# Altium schematic sheet FPGA_Configuration.SchDoc: FPGA_Configuration
size A3; Date: 18/06/2014; DrawnBy: J. Gabriel R.E.; Organization: Seven Solutions S.L.; Address1: C/Baza, Parcela 19, Nave 3; Address2: Polнgono Ind. Juncaril; Address3: 18210-Peligros-Granada; Address4: Spain; Revision: 3.4; SheetNumber: 8; SheetTotal: 23; WebAddress: www.sevensols.com; Project: White Rabbit; ProjectName: Project Name
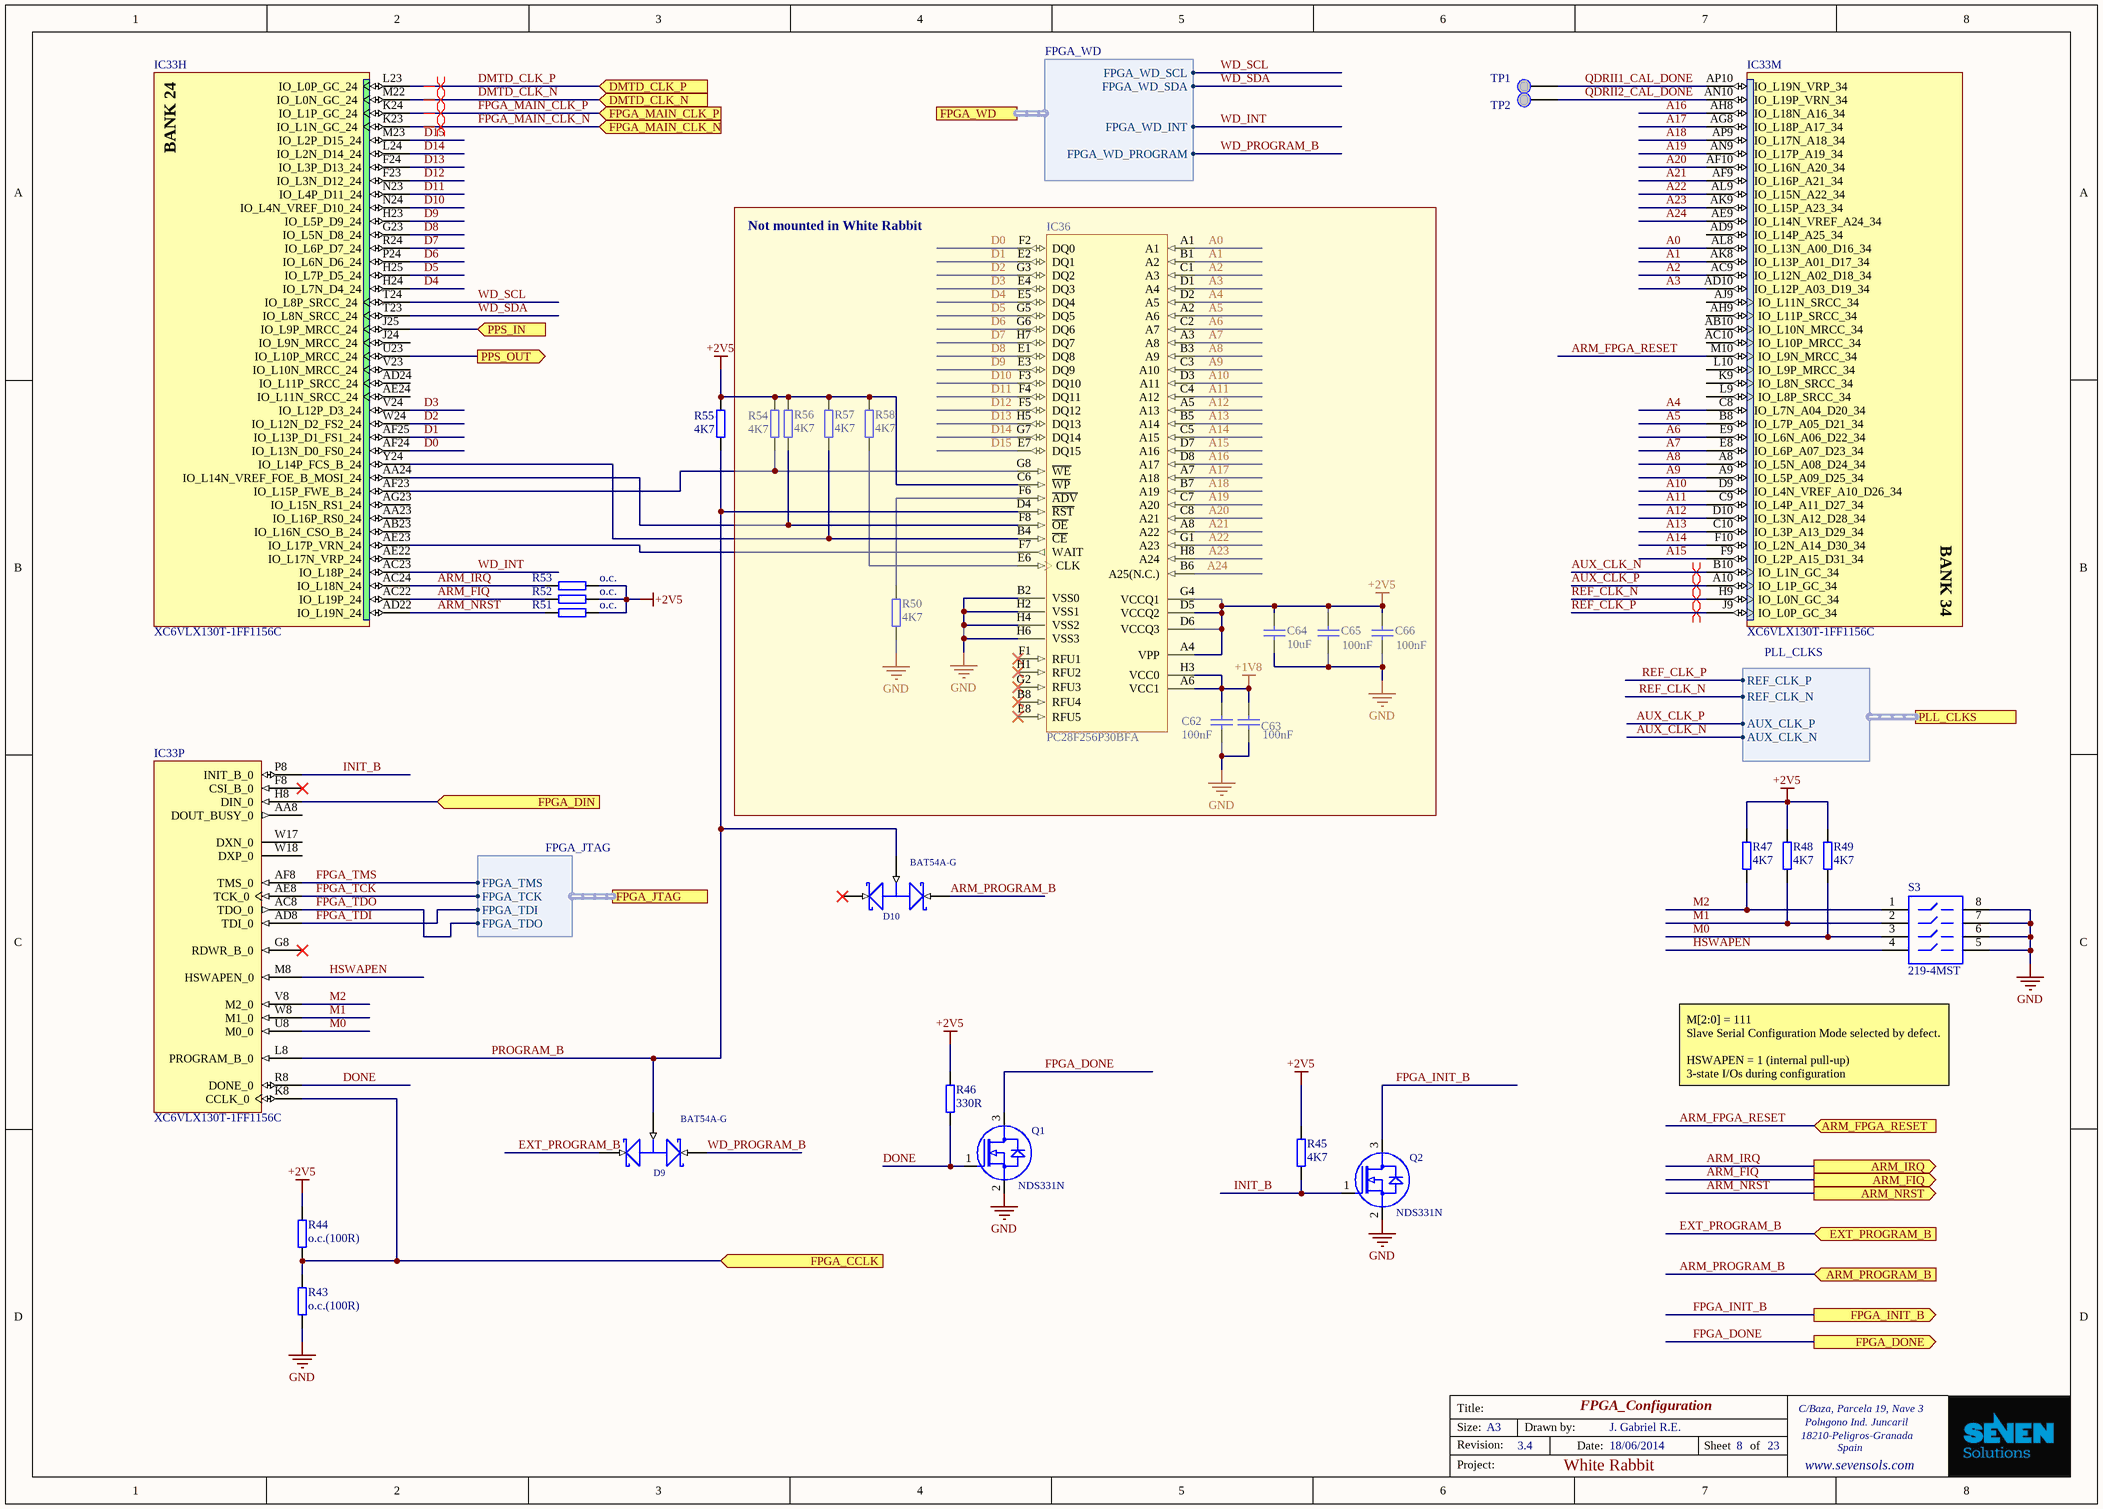
[diagram p0: FPGA_Configuration.SchDoc]

## Parts
C62  100nF  [CC1005-0402]
C63  100nF  [CC1005-0402]
C64  10uF  [CC1608-0603]
C65  100nF  [CC1005-0402]
C66  100nF  [CC1005-0402]
D9  BAT54A-G  [SOT23]
D10  BAT54A-G  [SOT23]
IC33  XC6VLX130T-1FF1156C  [FF1156]  (parts H,M,P of 20)
IC36  PC28F256P30BFA  [BGA64C100P8X8_1300X1000X120]
Q1  NDS331N  [SOT23-3]
Q2  NDS331N  [SOT23-3]
R43  value o.c.(100R)  [0402]  (hidden comment: 100R(o.c.))
R44  value o.c.(100R)  [0402]  (hidden comment: 100R(o.c.))
R45  4K7  [0402]
R46  330R  [0402]
R47  4K7  [0402]
R48  4K7  [0402]
R49  4K7  [0402]
R50  4K7  [0402]
R51  o.c.  [0402]
R52  o.c.  [0402]
R53  o.c.  [0402]
R54  4K7  [0402]
R55  4K7  [0402]
R56  4K7  [0402]
R57  4K7  [0402]
R58  4K7  [0402]
S3  219-4MST  [NHDS-8]
TP1  Test Point  [TEST_PAD_1mm]  (value not drawn)
TP2  Test Point  [TEST_PAD_1mm]  (value not drawn)

## Blocks framed on the sheet
Not mounted in White Rabbit: C62-C66 IC36 R50 R54 R56-R58

## Ports
ARM_FIQ (out), ARM_FPGA_RESET (in), ARM_IRQ (out), ARM_NRST (out), ARM_PROGRAM_B (in), DMTD_CLK_N (in), DMTD_CLK_P (in), EXT_PROGRAM_B (in), FPGA_CCLK (in), FPGA_DIN (in), FPGA_DONE (out), FPGA_INIT_B (out), FPGA_JTAG (harness FPGA_JTAG), FPGA_MAIN_CLK_N (in), FPGA_MAIN_CLK_P (in), FPGA_WD (harness FPGA_WD), PLL_CLKS (harness PLL_CLKS), PPS_IN (in), PPS_OUT (out)

## Harnesses
FPGA_JTAG: FPGA_TMS, FPGA_TCK, FPGA_TDI, FPGA_TDO
FPGA_WD: FPGA_WD_SCL, FPGA_WD_SDA, FPGA_WD_INT, FPGA_WD_PROGRAM
PLL_CLKS: REF_CLK_P, REF_CLK_N, AUX_CLK_P, AUX_CLK_N

## Nets
+1V8: C62.2 C63.2 IC36.A6(VCC1) IC36.H3(VCC0)
+2V5: C64.2 C65.2 C66.2 IC36.A4(VPP) IC36.C6(~{WP}) IC36.D5(VCCQ2) IC36.D6(VCCQ3) IC36.G4(VCCQ1) R44.2 R45.1 R46.2 R47.2 R48.2 R49.2 R51.1 R52.1 R53.1 R54.2 R55.2 R56.2 R57.2 R58.2
GND: C62.1 C63.1 C64.1 C65.1 C66.1 IC36.B2(VSS0) IC36.H2(VSS1) IC36.H4(VSS2) IC36.H6(VSS3) Q1.2(SOURCE) Q2.2(SOURCE) R43.1 R50.1 S3.5 S3.6 S3.7 S3.8
A0: IC33.AL8(IO_L13N_A00_D16_34) IC36.A1
A1: IC33.AK8(IO_L13P_A01_D17_34) IC36.B1(A2)
A2: IC33.AC9(IO_L12N_A02_D18_34) IC36.C1(A3)
A3: IC33.AD10(IO_L12P_A03_D19_34) IC36.D1(A4)
A4: IC33.C8(IO_L7N_A04_D20_34) IC36.D2(A5)
A5: IC33.B8(IO_L7P_A05_D21_34) IC36.A2(A6)
A6: IC33.E9(IO_L6N_A06_D22_34) IC36.C2(A7)
A7: IC33.E8(IO_L6P_A07_D23_34) IC36.A3(A8)
A8: IC33.A8(IO_L5N_A08_D24_34) IC36.B3(A9)
A9: IC33.A9(IO_L5P_A09_D25_34) IC36.C3(A10)
A10: IC33.D9(IO_L4N_VREF_A10_D26_34) IC36.D3(A11)
A11: IC33.C9(IO_L4P_A11_D27_34) IC36.C4(A12)
A12: IC33.D10(IO_L3N_A12_D28_34) IC36.A5(A13)
A13: IC33.C10(IO_L3P_A13_D29_34) IC36.B5(A14)
A14: IC33.F10(IO_L2N_A14_D30_34) IC36.C5(A15)
A15: IC33.F9(IO_L2P_A15_D31_34) IC36.D7(A16)
A16: IC33.AH8(IO_L18N_A16_34) IC36.D8(A17)
A17: IC33.AG8(IO_L18P_A17_34) IC36.A7(A18)
A18: IC33.AP9(IO_L17N_A18_34) IC36.B7(A19)
A19: IC33.AN9(IO_L17P_A19_34) IC36.C7(A20)
A20: IC33.AF10(IO_L16N_A20_34) IC36.C8(A21)
A21: IC33.AF9(IO_L16P_A21_34) IC36.A8(A22)
A22: IC33.AL9(IO_L15N_A22_34) IC36.G1(A23)
A23: IC33.AK9(IO_L15P_A23_34) IC36.H8(A24)
A24: IC33.AE9(IO_L14N_VREF_A24_34) IC36.B6(A25(N.C.))
ARM_FIQ: IC33.AC22(IO_L19P_24) R52.2 ; port ARM_FIQ
ARM_FPGA_RESET: IC33.M10(IO_L9N_MRCC_34) ; port ARM_FPGA_RESET
ARM_IRQ: IC33.AC24(IO_L18N_24) R53.2 ; port ARM_IRQ
ARM_NRST: IC33.AD22(IO_L19N_24) R51.2 ; port ARM_NRST
ARM_PROGRAM_B: D10.2(K2) ; port ARM_PROGRAM_B
AUX_CLK_N: IC33.B10(IO_L1N_GC_34) ; port PLL_CLKS.AUX_CLK_N
AUX_CLK_P: IC33.A10(IO_L1P_GC_34) ; port PLL_CLKS.AUX_CLK_P
D0: IC33.AF24(IO_L13N_D0_FS0_24) IC36.F2(DQ0)
D1: IC33.AF25(IO_L13P_D1_FS1_24) IC36.E2(DQ1)
D2: IC33.W24(IO_L12N_D2_FS2_24) IC36.G3(DQ2)
D3: IC33.V24(IO_L12P_D3_24) IC36.E4(DQ3)
D4: IC33.H24(IO_L7N_D4_24) IC36.E5(DQ4)
D5: IC33.H25(IO_L7P_D5_24) IC36.G5(DQ5)
D6: IC33.P24(IO_L6N_D6_24) IC36.G6(DQ6)
D7: IC33.R24(IO_L6P_D7_24) IC36.H7(DQ7)
D8: IC33.G23(IO_L5N_D8_24) IC36.E1(DQ8)
D9: IC33.H23(IO_L5P_D9_24) IC36.E3(DQ9)
D10: IC33.N24(IO_L4N_VREF_D10_24) IC36.F3(DQ10)
D11: IC33.N23(IO_L4P_D11_24) IC36.F4(DQ11)
D12: IC33.F23(IO_L3N_D12_24) IC36.F5(DQ12)
D13: IC33.F24(IO_L3P_D13_24) IC36.H5(DQ13)
D14: IC33.L24(IO_L2N_D14_24) IC36.G7(DQ14)
D15: IC33.M23(IO_L2P_D15_24) IC36.E7(DQ15)
DMTD_CLK_N: IC33.M22(IO_L0N_GC_24) ; port DMTD_CLK_N
DMTD_CLK_P: IC33.L23(IO_L0P_GC_24) ; port DMTD_CLK_P
DONE: IC33.R8(DONE_0) Q1.1(GATE) R46.1
EXT_PROGRAM_B: D9.1(K1) ; port EXT_PROGRAM_B
FPGA_CCLK: IC33.K8(CCLK_0) R43.2 R44.1 ; port FPGA_CCLK
FPGA_DIN: IC33.H8(DIN_0) ; port FPGA_DIN
FPGA_DONE: Q1.3(DRAIN) ; port FPGA_DONE
FPGA_INIT_B: Q2.3(DRAIN) ; port FPGA_INIT_B
FPGA_MAIN_CLK_N: IC33.K23(IO_L1N_GC_24) ; port FPGA_MAIN_CLK_N
FPGA_MAIN_CLK_P: IC33.K24(IO_L1P_GC_24) ; port FPGA_MAIN_CLK_P
FPGA_TCK: IC33.AE8(TCK_0) ; port FPGA_JTAG.FPGA_TCK
FPGA_TDI: IC33.AD8(TDI_0) ; port FPGA_JTAG.FPGA_TDI
FPGA_TDO: IC33.AC8(TDO_0) ; port FPGA_JTAG.FPGA_TDO
FPGA_TMS: IC33.AF8(TMS_0) ; port FPGA_JTAG.FPGA_TMS
HSWAPEN: IC33.M8(HSWAPEN_0) S3.4
INIT_B: IC33.P8(INIT_B_0) Q2.1(GATE) R45.2
M0: IC33.U8(M0_0) R49.1 S3.3
M1: IC33.W8(M1_0) R48.1 S3.2
M2: IC33.V8(M2_0) R47.1 S3.1
PPS_IN: IC33.J25(IO_L9P_MRCC_24) ; port PPS_IN
PPS_OUT: IC33.U23(IO_L10P_MRCC_24) ; port PPS_OUT
PROGRAM_B: D9.3(A) D10.3(A) IC33.L8(PROGRAM_B_0) IC36.D4(~{RST}) R55.1
QDRII1_CAL_DONE: IC33.AP10(IO_L19N_VRP_34) TP1.1(TP)
QDRII2_CAL_DONE: IC33.AN10(IO_L19P_VRN_34) TP2.1(TP)
REF_CLK_N: IC33.H9(IO_L0N_GC_34) ; port PLL_CLKS.REF_CLK_N
REF_CLK_P: IC33.J9(IO_L0P_GC_34) ; port PLL_CLKS.REF_CLK_P
WD_INT: IC33.AC23(IO_L18P_24) ; port FPGA_WD.FPGA_WD_INT
WD_PROGRAM_B: D9.2(K2) ; port FPGA_WD.FPGA_WD_PROGRAM
WD_SCL: IC33.T24(IO_L8P_SRCC_24) ; port FPGA_WD.FPGA_WD_SCL
WD_SDA: IC33.T23(IO_L8N_SRCC_24) ; port FPGA_WD.FPGA_WD_SDA
NetIC33_AA24: IC33.AA24(IO_L14N_VREF_FOE_B_MOSI_24) IC36.F8(~{OE}) R56.1
NetIC33_AE23: IC33.AE23(IO_L17P_VRN_24) IC36.F7(WAIT)
NetIC33_AF23: IC33.AF23(IO_L15P_FWE_B_24) IC36.G8(~{WE}) R54.1
NetIC33_Y24: IC33.Y24(IO_L14P_FCS_B_24) IC36.B4(~{CE}) R57.1
NetIC36_E6: IC36.E6(CLK) R58.1
NetIC36_F6: IC36.F6(~{ADV}) R50.2

Not connected (* = marked no-connect by the designer): D10 1(K1)*; IC33 AA8(DOUT_BUSY_0) AA23(IO_L16P_RS0_24) AB10(IO_L10N_MRCC_34) AB23(IO_L16N_CSO_B_24) AC10(IO_L10P_MRCC_34) AD9(IO_L14P_A25_34) AD24(IO_L11P_SRCC_24) AE22(IO_L17N_VRP_24) AE24(IO_L11N_SRCC_24) AG23(IO_L15N_RS1_24) AH9(IO_L11P_SRCC_34) AJ9(IO_L11N_SRCC_34) F8(CSI_B_0)* G8(RDWR_B_0)* J24(IO_L9N_MRCC_24) K9(IO_L8N_SRCC_34) L9(IO_L8P_SRCC_34) L10(IO_L9P_MRCC_34) V23(IO_L10N_MRCC_24) W17(DXN_0) W18(DXP_0); IC36 B8(RFU4)* E8(RFU5)* F1(RFU1)* G2(RFU3)* H1(RFU2)*

## Layout directives
differential pair: AUX_CLK_N, AUX_CLK_P, DMTD_CLK_N, DMTD_CLK_P, FPGA_MAIN_CLK_N, FPGA_MAIN_CLK_P, REF_CLK_N, REF_CLK_P

## Notes on the sheet
- M[2:0] = 111
  Slave Serial Configuration Mode selected by defect.
  HSWAPEN = 1 (internal pull-up)
  3-state I/Os during configuration
- Title:
- Size:
- Revision:
- A3
- Drawn by:
- Date:
- Sheet
- of
- Project:
- (in symbol XC6VLX130T-1FF1156C, part H) BANK 24
- (in symbol XC6VLX130T-1FF1156C, part M) BANK 34

## Library data of the parts
C62 C63 C65 C66 = CC0402_100NF_16V_10%_X7R: Capacitor; Manufacturer1: TDK; Manufacturer1 PN: C1005X7R1C104K; TC: X7R; Tolerance: ±10%; Voltage: 16V; Mounted: No; Published: 8-Jun-2000; LatestRevisionDate: 17-Jul-2002; LatestRevisionNote: Re-released for DXP Platform.; PackageReference: RAD-0.3; Publisher: Altium Limited; Distributor1: Digikey; Distributor1 PN: 445-4952-1-ND; Case: 0402; Value: 100nF
C64 = CC0603_10UF_6.3V_20%_X5R: Capacitor; Manufacturer1: TDK; Manufacturer1 PN: C1608X5R0J106M; TC: X5R; Tolerance: ±20%; Voltage: 6.3V; Mounted: No; Published: 8-Jun-2000; LatestRevisionDate: 17-Jul-2002; LatestRevisionNote: Re-released for DXP Platform.; PackageReference: RAD-0.3; Publisher: Altium Limited; Distributor1: Digikey; Distributor1 PN: 445-4112-1-ND; Case: 0603; Value: 10uF
D9 D10 = BAT54A.1: Schottky Barrier Double Diode; PACKAGE_INFORMATION: Latest Revision: May-1999; DEVICE: BAT54A-G; PKG_TYPE: SOT23; PUBLISHED: 17-Sep-2003; DATASHEET: Latest Revision: 4-Mar-2002; PACKAGE_REFERENCE: SOT23; PUBLISHER: Altium Limited; Value: BAT54A-G; Distributor1 PN: 641-1319-1-ND; Distributor1: Digikey
IC33 = XC6VLX130T-1FF1156C: Virtex-6 LXT Platform FPGA, 600 User I/Os, 20 GTXs, 1156-Ball FFBGA, Speed Grade 1, Commercial Grade; FirstPublished: 17-Nov-2009; DatasheetVersion: v2.0, Sep-2009; PackageVersion: ver1.0, Jun-2009; PackageReference: FF1156; Publisher: Altium Limited; PackageDescription: 1156-Ball Flip-Chip Fine Pitch Ball Grid Array (FF1156); Code_JEDEC: MS-034-AAR-1; Code_IPC: BGA100P34X34-1156; ComponentLink1Description: Virtex-6 Datasheet; ComponentLink1URL: http://www.xilinx.com/support/documentation/data_sheets/ds150.pdf; ComponentLink2Description: Pinout Specification; ComponentLink2URL: http://www.xilinx.com/support/packagefiles/virtex-6-pkgs.htm; ComponentLink3Description: FF1156 Package Drawing; ComponentLink3URL: http://www.xilinx.com/support/documentation/package_specs/ff1156.pdf; ComponentLink4Description: Virtex-6 Documents; ComponentLink4URL: http://www.xilinx.com/support/documentation/virtex-6.htm; ComponentLink5Description: Xilinx.com Home; ComponentLink5URL: http://www.xilinx.com
IC36 = PC28F256P30BFA: NOR Flash Memory, 256Mbit; Mounted: No; Value: PC28F256P30BFA; Distributor1 PN: PC28F256P30BFA-ND; Distributor1: Digikey; Case: TBGA-64
Q1 Q2 = NDS331N: N-Channel Logic Level Enhancement Mode Field Effect Transistor; DEVICE: NDS331N; VALUE: NDS331N; Distributor1 PN: NDS331NCT-ND; Distributor1: Digikey
R43 = R0402_100R_±1%_0.1W_100PPM: SMD Resistor; Manufacturer1: Panasonic; Manufacturer1 PN: ERJ-2RKF1000X; TCR: 100ppm; Power Rating: 0.1W; Tolerance: ±1%; Mounted: No; Case: 0402; Distributor1: DigiKey; Distributor1 PN: P100LCT-ND
R44 = R0402_100R_±1%_0.1W_100PPM: SMD Resistor; Manufacturer1: Panasonic; Manufacturer1 PN: ERJ-2RKF1000X; TCR: 100ppm; Power Rating: 0.1W; Tolerance: ±1%; Case: 0402; Distributor1: DigiKey; Distributor1 PN: P100LCT-ND
R45 R47-R49 R55 = R0402_4.7K_±1%_0.1W_100PPM: SMD Resistor; Manufacturer1: Panasonic; Manufacturer1 PN: ERJ-2RKF4701X; TCR: 100ppm; Power Rating: 0.1W; Tolerance: ±1%; Case: 0402; Distributor1: DigiKey; Distributor1 PN: ERJ-2RKF4701X; Value: 4K7
R46 = R0402_330R_±1%_0.1W_100PPM: SMD Resistor; Manufacturer1: Panasonic; Manufacturer1 PN: ERJ-2RKF3300X; TCR: 100ppm; Power Rating: 0.1W; Tolerance: ±1%; Case: 0402; Distributor1: DigiKey; Distributor1 PN: P330LCT-ND; Value: 330R
R50 R54 R56-R58 = R0402_4.7K_±1%_0.1W_100PPM: SMD Resistor; Manufacturer1: Panasonic; Manufacturer1 PN: ERJ-2RKF4701X; TCR: 100ppm; Power Rating: 0.1W; Tolerance: ±1%; Mounted: No; Case: 0402; Distributor1: DigiKey; Distributor1 PN: ERJ-2RKF4701X; Value: 4K7
R51-R53 = R0402_O.C.: SMD Resistor; Mounted: No; Case: 0402; Manufacturer1: N/A; Manufacturer1 PN: N/A; Distributor1: N/A; Distributor1 PN: N/A; TCR: N/A; Power Rating: N/A; Tolerance: N/A; Value: o.c.
S3 = SW-DIP4: 4 Positions DIP SWITCH; Manufacturer: CTS Electrocomponents; Mounted: No; Value: 219-4MST; Distributor1 PN: CT2194MST-ND; Distributor1: Digikey
TP1 TP2 = TEST_POINT: SMD 1mm Test Point